# Altium schematic sheet PCI_Express.SchDoc
size A3; PageSetup: Record=PageOptions|CenterHorizontal=True|CenterVertical=True|PrintScale=0.73|XCorrection=1.00|YCorrection=1.00|PrintKind=0|BorderSize=5000000|LeftOffset=0|BottomOffset=0|Orientation=2|PaperLength=1000|PaperWidth=1000|Scale=100|PaperSource=7|PrintQuality=-4|MediaType=1|DitherType=10|PaperKind=A4|PrintScaleMode=1; Date: 27.05.2014; DrawnBy: luths8; Organization: BFH; Address1: Bern University of Applied Sciences; Address2: Engineering and Information Technology; Address3: Jlcoweg 1; Address4: CH-3400 Burgdorf; DocumentNumber: 14; Revision: 1.0; SheetNumber: 17; SheetTotal: 19; CurrentDate: 27.05.2014
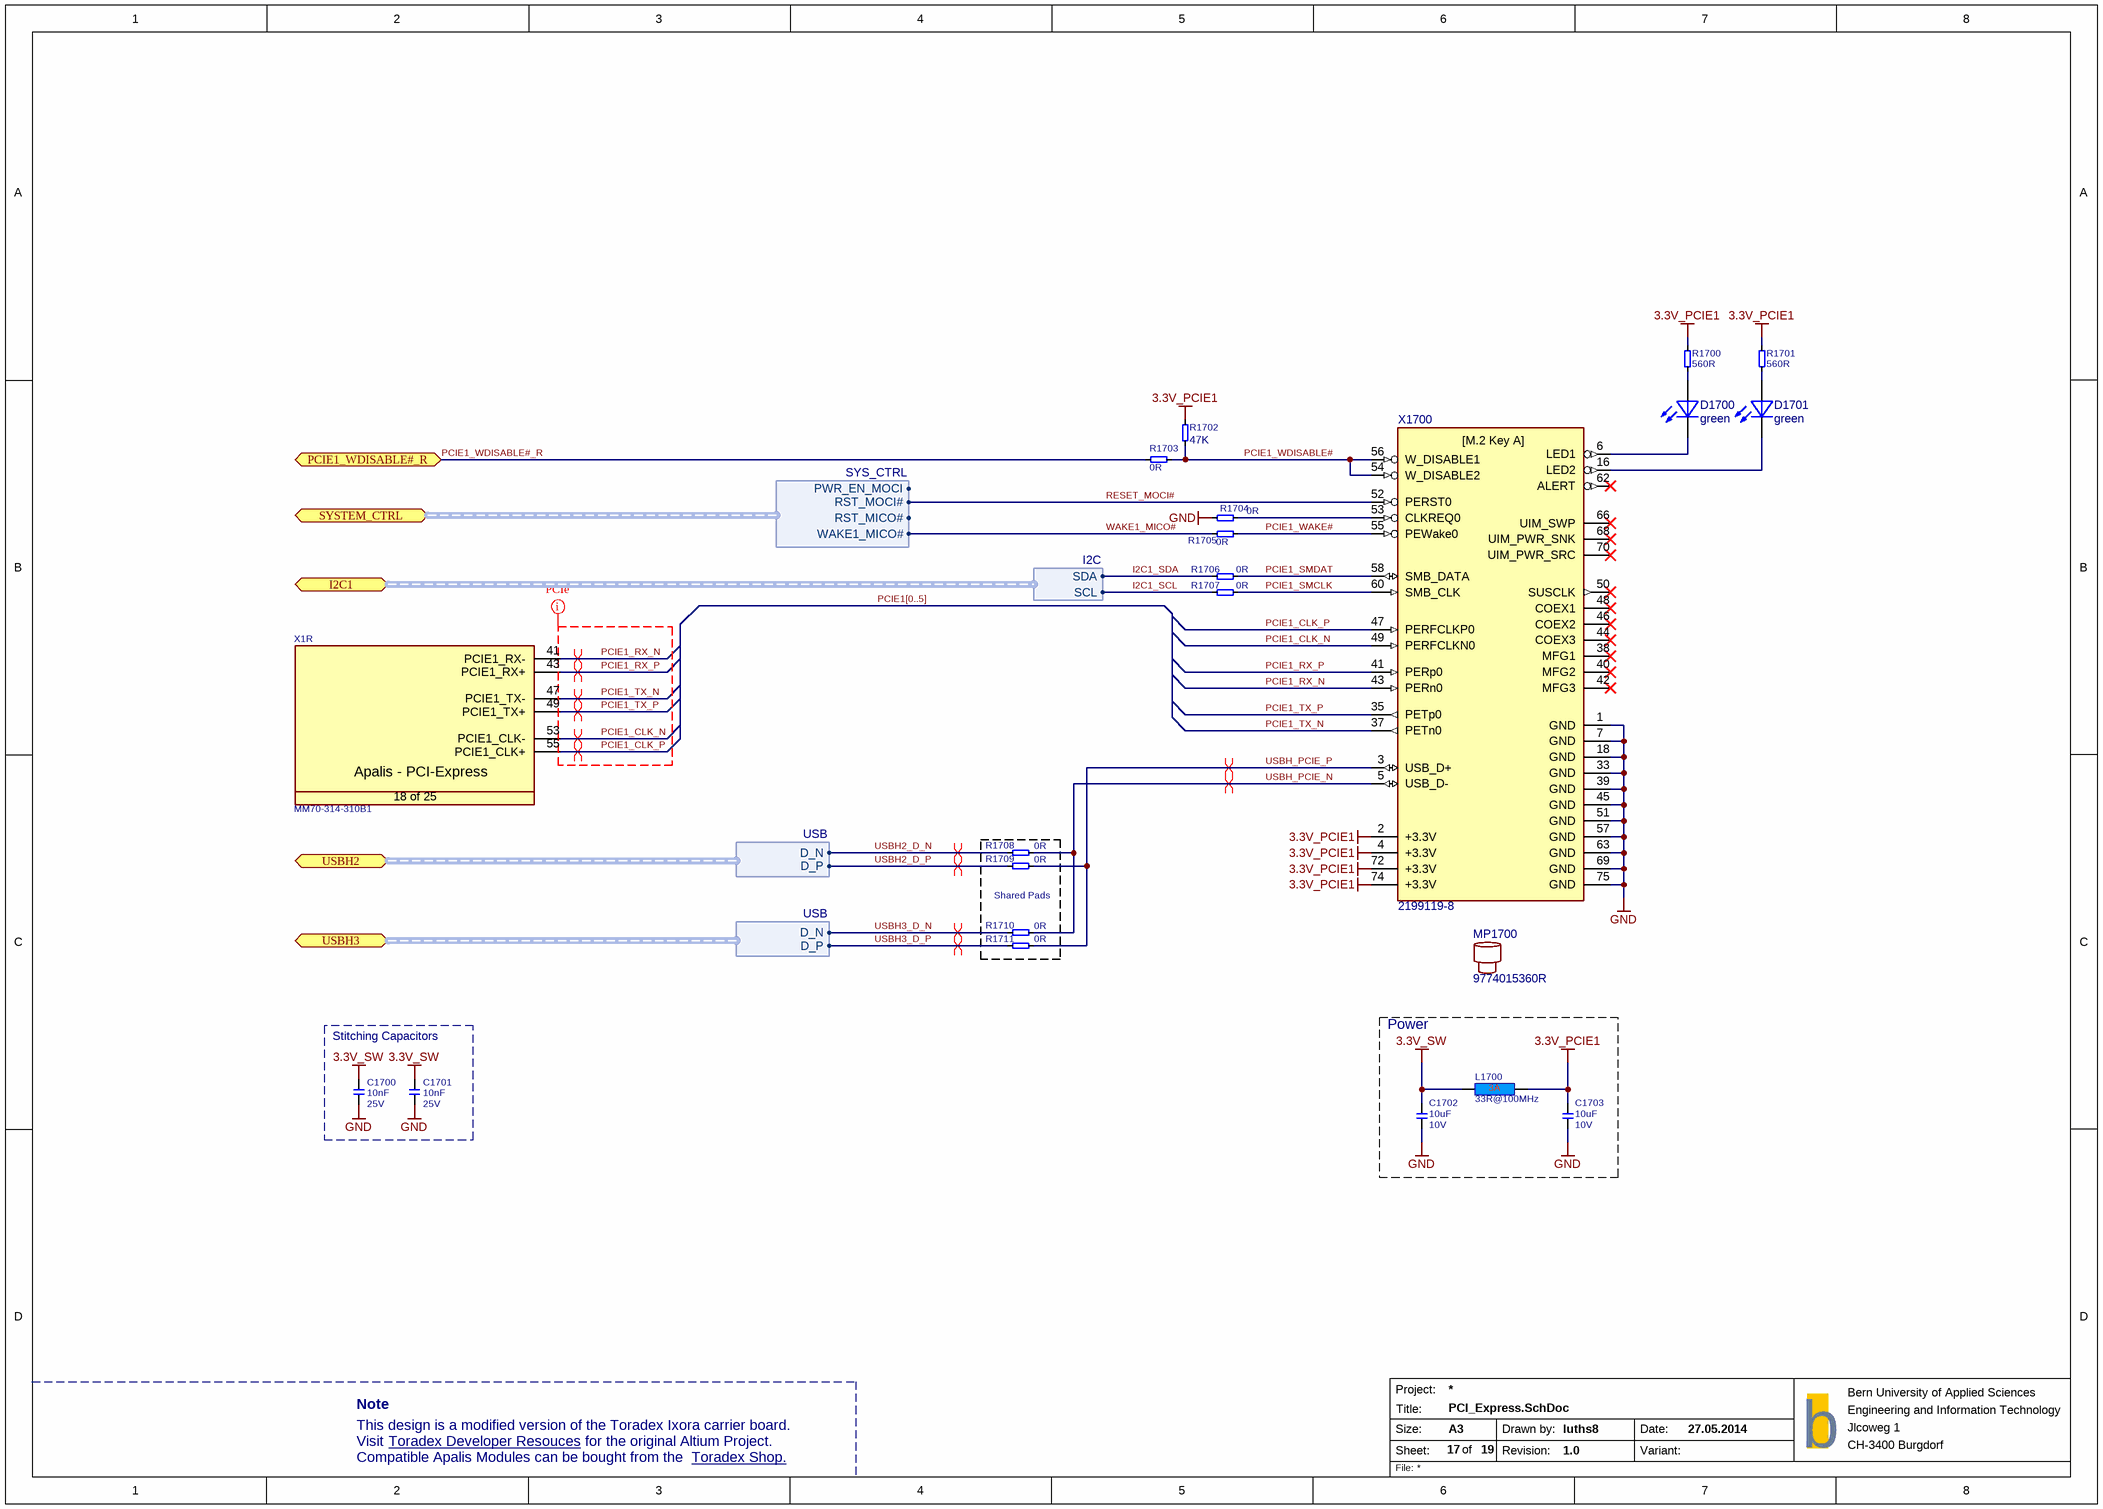
[diagram p0: PCI_Express.SchDoc]

## Parts
C1700  10nF  Rating: 25V  [SMD0603CAP]
C1701  10nF  Rating: 25V  [SMD0603CAP]
C1702  Rating: 10V  [SMD0603CAP]  (hidden comment: 10uF)
C1703  Rating: 10V  [SMD0603CAP]  (hidden comment: 10uF)
D1700  green  [LED]
D1701  green  [LED]
L1700  33R@100MHz  [INDC1608X95N]
MP1700  9774015360R
R1700  560R  [SMD0603RES]
R1701  560R  [SMD0603RES]
R1702  47K  [SMD0603RES]
R1703  0R  [SMD0603RES]
R1704  0R  [SMD0603RES]
R1705  0R  [SMD0603RES]
R1706  0R  [SMD0603RES]
R1707  0R  [SMD0603RES]
R1708  0R  [SMD0603RES]
R1709  0R  [SMD0603RES]
R1710  0R  [SMD0603RES]
R1711  0R  [SMD0603RES]
X1  Manufacturer Part No.: MM70-314-310B1  [T_JAE_MM70-314-310B1]  (hidden comment: CON-JAE-MM70-314-310B1-314-0.5mm)  (part R of 25)
X1700  2199119-8  [2199119-8-KEY-A-2230]

## Blocks framed on the sheet
Shared Pads: R1708-R1711
Stitching Capacitors: C1700 C1701
Power: C1702 C1703 L1700

## Ports
I2C1 (bidir, harness I2C, see 12, 17, 19, 5), PCIE1_WDISABLE#_R (bidir, see 19), SYSTEM_CTRL (bidir, harness SYS_CTRL, see 12, 19, 4), USBH2 (bidir, harness USB, see 6, 7), USBH3 (bidir, harness USB, see 6, 7)

## Harnesses
USB: D_N, D_P
I2C: SCL, SDA
SYS_CTRL: PWR_EN_MOCI, RST_MOCI#, RST_MICO#, WAKE1_MICO#

## Nets
3.3V_PCIE1: C1703.2 L1700.2 R1700.1 R1701.1 R1702.2 X1700.2(+3.3V) X1700.4(+3.3V) X1700.72(+3.3V) X1700.74(+3.3V)
3.3V_SW: C1700.2 C1701.2 C1702.2 L1700.1
GND: C1700.1 C1701.1 C1702.1 C1703.1 R1704.1 X1700.1(GND) X1700.7(GND) X1700.18(GND) X1700.33(GND) X1700.39(GND) X1700.45(GND) X1700.51(GND) X1700.57(GND) X1700.63(GND) X1700.69(GND) X1700.75(GND)
I2C1_SCL: R1707.1 ; port I2C1.SCL
I2C1_SDA: R1706.1 ; port I2C1.SDA
PCIE1_CLK_N: X1.53(PCIE1_CLK-) X1700.49(PERFCLKN0)
PCIE1_CLK_P: X1.55(PCIE1_CLK+) X1700.47(PERFCLKP0)
PCIE1_RX_N: X1.41(PCIE1_RX-) X1700.43(PERn0)
PCIE1_RX_P: X1.43(PCIE1_RX+) X1700.41(PERp0)
PCIE1_SMCLK: R1707.2 X1700.60(SMB_CLK)
PCIE1_SMDAT: R1706.2 X1700.58(SMB_DATA)
PCIE1_TX_N: X1.47(PCIE1_TX-) X1700.37(PETn0)
PCIE1_TX_P: X1.49(PCIE1_TX+) X1700.35(PETp0)
PCIE1_WAKE#: R1705.2 X1700.55(PEWake0)
PCIE1_WDISABLE#: R1702.1 R1703.1 X1700.54(W_DISABLE2) X1700.56(W_DISABLE1)
PCIE1_WDISABLE#_R: R1703.2 ; port PCIE1_WDISABLE#_R
RESET_MOCI#: X1700.52(PERST0) ; port SYSTEM_CTRL.RST_MOCI#
USBH2_D_N: R1708.1 ; port USBH2.D_N
USBH2_D_P: R1709.1 ; port USBH2.D_P
USBH3_D_N: R1710.1 ; port USBH3.D_N
USBH3_D_P: R1711.1 ; port USBH3.D_P
USBH_PCIE_N: R1708.2 R1710.2 X1700.5(USB_D-)
USBH_PCIE_P: R1709.2 R1711.2 X1700.3(USB_D+)
WAKE1_MICO#: R1705.1 ; port SYSTEM_CTRL.WAKE1_MICO#
NetD1700_A: D1700.A R1700.2
NetD1700_C: D1700.C X1700.6(LED1)
NetD1701_A: D1701.A R1701.2
NetD1701_C: D1701.C X1700.16(LED2)
NetR1704_2: R1704.2 X1700.53(CLKREQ0)

Not connected (* = marked no-connect by the designer): X1700 38(MFG1)* 40(MFG2)* 42(MFG3)* 44(COEX3)* 46(COEX2)* 48(COEX1)* 50(SUSCLK)* 62(ALERT)* 66(UIM_SWP)* 68(UIM_PWR_SNK)* 70(UIM_PWR_SRC)*

## Buses and harness runs
bus PCIE1[0..5]

## Layout directives
differential pair: PCIE1_CLK_N, PCIE1_CLK_P, PCIE1_RX_N, PCIE1_RX_P, PCIE1_TX_N, PCIE1_TX_P, USBH2_D_N, USBH2_D_P, USBH3_D_N, USBH3_D_P, USBH_PCIE_N, USBH_PCIE_P
net class PCIe: PCIE1_CLK_N, PCIE1_CLK_P, PCIE1_RX_N, PCIE1_RX_P, PCIE1_TX_N, PCIE1_TX_P

## Notes on the sheet
- Note
- This design is a modified version of the Toradex Ixora carrier board.
- Visit
- Compatible Apalis Modules can be bought from the
- Toradex Developer Resouces <https://developer.toradex.com/products/ixora-carrier-board>
- for the original Altium Project.
- Toradex Shop. <https://www.toradex.com/order-now/apalis-arm-family>
- Project:
- Size:
- Sheet:
- Title:
- A3
- of
- Drawn by:
- Revision:
- Date:
- Variant:
- b
- File:
- (in symbol CON-JAE-MM70-314-310B1-314-0.5mm, part R) Apalis - PCI-Express; 18 of 25
- (in symbol Connector M.2 Key A) [M.2 Key A]

## Library data of the parts
C1700 C1701 = C-X7R-10nF-25V-10%-0603: Capacitor Ceramic X7R 10nF 25V 10% 0603; Tolerance: 10%; Type: X7R; Value: 10nF
C1702 C1703 = C-X5R-10uF-10V-20%-0603: Capacitor Ceramic X5R 10uF 10V 20% 0603; Tolerance: 20%; Type: X5R; Value: 10uF
D1700 D1701 = LED green: Manufacturer Part No.: LGM67KG1J224Z
L1700 = L-33R@100MHz-3A-25%-0603: 33R@100MHz 3A EMI FILTER; Tolerance: 25%; Rating: 3A; Value: 33R@100MHz
MP1700 = Spacer M3 SMD: Manufacturer Part No.: 9774015360R
R1700 R1701 = R-560R-63mW-5%-0402: Resistor 560 ohm 63mW 5% 0603; Rating: 63mW; Tolerance: 5%; Value: 560R
R1702 = R-47KR-63mW-5%-0603: Resistor 47 Kohm 63mW 5% 0603; Value: 47KR; Rating: 63mW; Tolerance: 5%
R1703-R1705 R1708-R1711 = R-0R-63mW-1%-0603: Resistor 0 ohm 63mW 1% 0603; Rating: 63mW; Tolerance: 1%; Value: 0R
R1706 R1707 = R-0R-63mW-1%-0402: Resistor 0 ohm 63mW 1% 0603; Rating: 63mW; Tolerance: 1%; Value: 0R
X1 = CON-JAE-MM70-314-310B1-314-0.5mm: MXM3 Connector; Manufacturer Name: JAE; No. of ways: 314
X1700 = Connector M.2 Key A: Manufacturer Part No.: 2199119-8